# Altium project CRD25DA12N-FMC V2 (09-2024).PrjPcb (part 2 of 9)

## Sheet 03 - Controller.SchDoc: Controller - 25kW WolfPACK FM3 Six-Pack Inverter
size 431 x 279 mm; Date: 09/2024; DocumentNumber: CRD25DA12N-FMC; Revision: 2.0; SheetNumber: 3; SheetTotal: 9; SheetSize: B
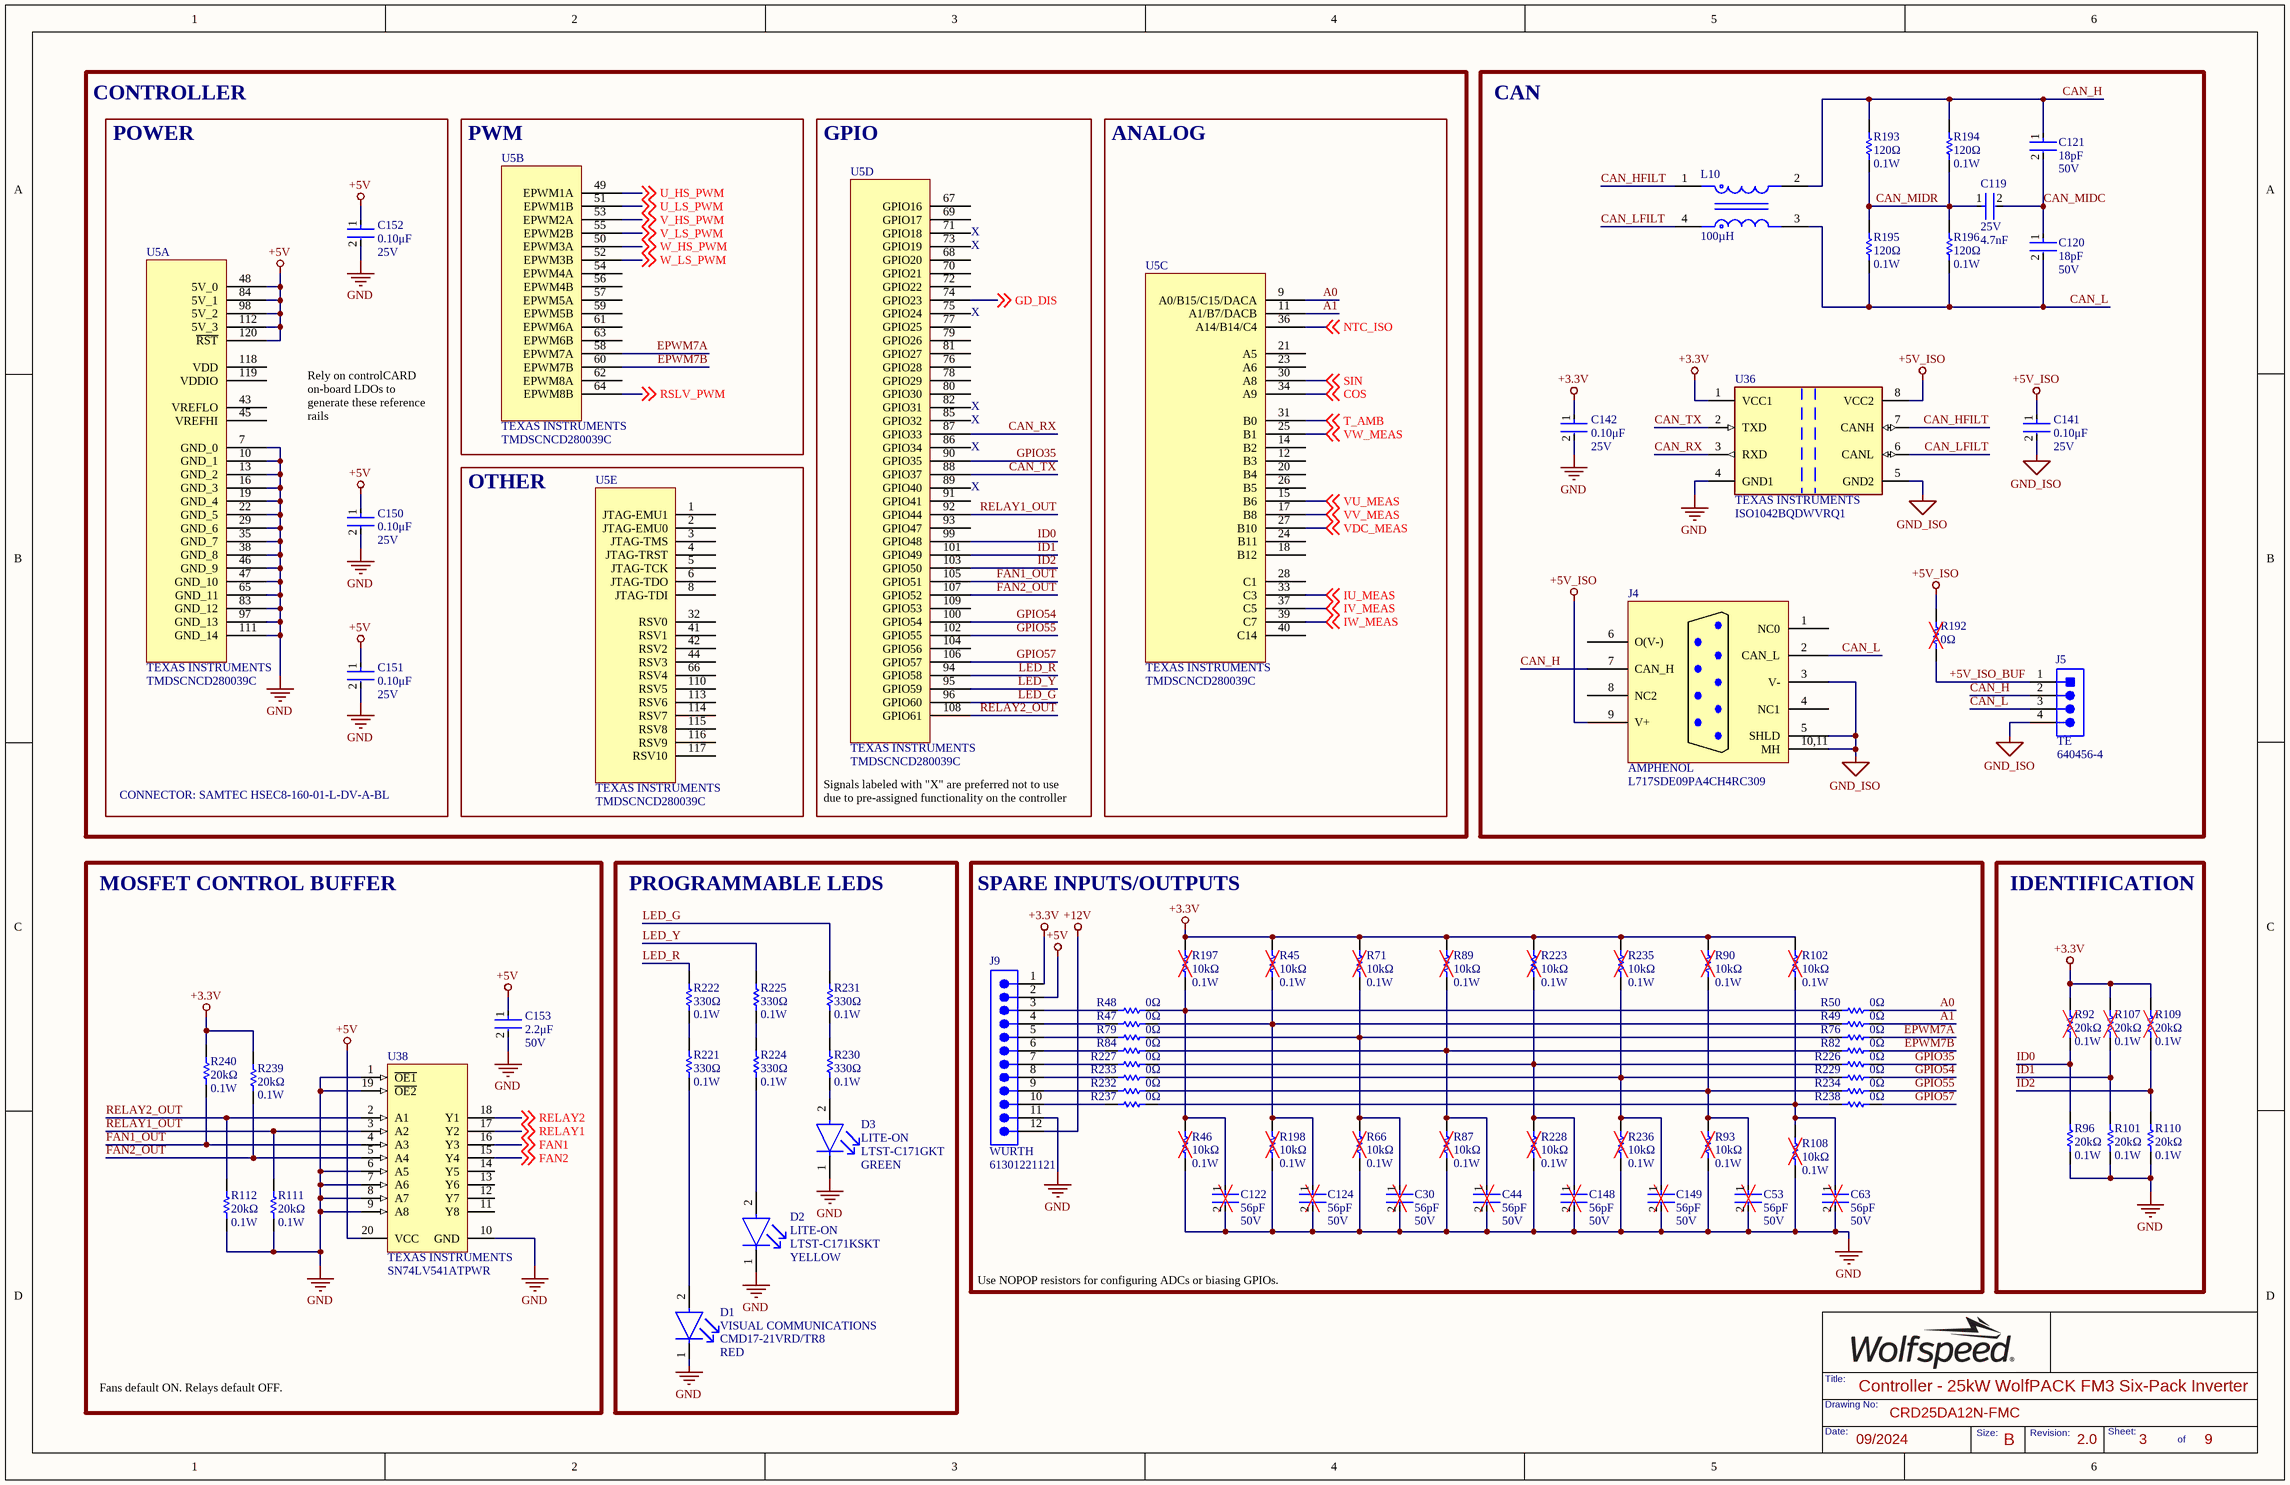
[diagram p2: 03 - Controller.SchDoc]

### Parts
C30  Capacitance: 56pF  Voltage Rating: 50V  [FP-C0603C-CF-IPC_B]  (hidden comment: CL10C560JB8NNNC)
C44  Capacitance: 56pF  Voltage Rating: 50V  [FP-C0603C-CF-IPC_B]  (hidden comment: CL10C560JB8NNNC)
C53  Capacitance: 56pF  Voltage Rating: 50V  [FP-C0603C-CF-IPC_B]  (hidden comment: CL10C560JB8NNNC)
C63  Capacitance: 56pF  Voltage Rating: 50V  [FP-C0603C-CF-IPC_B]  (hidden comment: CL10C560JB8NNNC)
C119  Voltage Rating: 25V  Capacitance: 4.7nF  [FP-C0603C-CF-IPC_B]  (hidden comment: C0603C472K3RAC7867)
C120  Capacitance: 18pF  Voltage Rating: 50V  [FP-C0603C-CF-IPC_B]  (hidden comment: 06035A180JAT2A)
C121  Capacitance: 18pF  Voltage Rating: 50V  [FP-C0603C-CF-IPC_B]  (hidden comment: 06035A180JAT2A)
C122  Capacitance: 56pF  Voltage Rating: 50V  [FP-C0603C-CF-IPC_B]  (hidden comment: CL10C560JB8NNNC)
C124  Capacitance: 56pF  Voltage Rating: 50V  [FP-C0603C-CF-IPC_B]  (hidden comment: CL10C560JB8NNNC)
C141  Voltage Rating: 25V  Capacitance: 0.10μF  [FP-C0603C-CF-IPC_B]  (hidden comment: C0603C104K3RACTU)
C142  Voltage Rating: 25V  Capacitance: 0.10μF  [FP-C0603C-CF-IPC_B]  (hidden comment: C0603C104K3RACTU)
C148  Capacitance: 56pF  Voltage Rating: 50V  [FP-C0603C-CF-IPC_B]  (hidden comment: CL10C560JB8NNNC)
C149  Capacitance: 56pF  Voltage Rating: 50V  [FP-C0603C-CF-IPC_B]  (hidden comment: CL10C560JB8NNNC)
C150  Voltage Rating: 25V  Capacitance: 0.10μF  [FP-C0603C-CF-IPC_B]  (hidden comment: C0603C104K3RACTU)
C151  Voltage Rating: 25V  Capacitance: 0.10μF  [FP-C0603C-CF-IPC_B]  (hidden comment: C0603C104K3RACTU)
C152  Voltage Rating: 25V  Capacitance: 0.10μF  [FP-C0603C-CF-IPC_B]  (hidden comment: C0603C104K3RACTU)
C153  Voltage Rating: 50V  Capacitance: 2.2μF  [FP-C0603C-CF-IPC_B]  (hidden comment: GRT188R61H225ME13D)
D1  value RED  Manufacturer: VISUAL COMMUNICATIONS  [FP-LTST-C171GKT-MFG-RED]  (hidden comment: CMD17-21VRD/TR8)
D2  LTST-C171KSKT  value YELLOW  Manufacturer: LITE-ON  [FP-LTST-C171GKT-MFG-YELLOW]
D3  value GREEN  Manufacturer: LITE-ON  [FP-LTST-C171GKT-MFG]  (hidden comment: LTST-C171GKT)
J4  Manufacturer: AMPHENOL  [L717SDE09PA4CH4RC309]  (hidden comment: L717SDE09PA4CH4RC309)
J5  Manufacturer: TE  [TECO-640456-4]  (hidden comment: 640456-4)
J9  Manufacturer Print: WURTH  [FP-61301221121-MFG]  (hidden comment: 61301221121)
L10  value 100µH  [FP-DLW43-0_2-t2_6-e0_6-MFG]  (hidden comment: DLW43SH101XK2L)
R45  Resistance: 10kΩ  Max Power Dissipation: 0.1W  [FP-MCR03-IPC_B]  (hidden comment: ERJ3EKF1002V)
R46  Resistance: 10kΩ  Max Power Dissipation: 0.1W  [FP-MCR03-IPC_B]  (hidden comment: ERJ3EKF1002V)
R47  Resistance: 0Ω  [FP-MCR03-IPC_B]  (hidden comment: CRCW06030000Z0EB)
R48  Resistance: 0Ω  [FP-MCR03-IPC_B]  (hidden comment: CRCW06030000Z0EB)
R49  Resistance: 0Ω  [FP-MCR03-IPC_B]  (hidden comment: CRCW06030000Z0EB)
R50  Resistance: 0Ω  [FP-MCR03-IPC_B]  (hidden comment: CRCW06030000Z0EB)
R66  Resistance: 10kΩ  Max Power Dissipation: 0.1W  [FP-MCR03-IPC_B]  (hidden comment: ERJ3EKF1002V)
R71  Resistance: 10kΩ  Max Power Dissipation: 0.1W  [FP-MCR03-IPC_B]  (hidden comment: ERJ3EKF1002V)
R76  Resistance: 0Ω  [FP-MCR03-IPC_B]  (hidden comment: CRCW06030000Z0EB)
R79  Resistance: 0Ω  [FP-MCR03-IPC_B]  (hidden comment: CRCW06030000Z0EB)
R82  Resistance: 0Ω  [FP-MCR03-IPC_B]  (hidden comment: CRCW06030000Z0EB)
R84  Resistance: 0Ω  [FP-MCR03-IPC_B]  (hidden comment: CRCW06030000Z0EB)
R87  Resistance: 10kΩ  Max Power Dissipation: 0.1W  [FP-MCR03-IPC_B]  (hidden comment: ERJ3EKF1002V)
R89  Resistance: 10kΩ  Max Power Dissipation: 0.1W  [FP-MCR03-IPC_B]  (hidden comment: ERJ3EKF1002V)
R90  Resistance: 10kΩ  Max Power Dissipation: 0.1W  [FP-MCR03-IPC_B]  (hidden comment: ERJ3EKF1002V)
R92  Resistance: 20kΩ  Power Rating: 0.1W  [FP-MCR03-IPC_B]  (hidden comment: CRCW060320K0FKTA)
R93  Resistance: 10kΩ  Max Power Dissipation: 0.1W  [FP-MCR03-IPC_B]  (hidden comment: ERJ3EKF1002V)
R96  Resistance: 20kΩ  Power Rating: 0.1W  [FP-MCR03-IPC_B]  (hidden comment: CRCW060320K0FKTA)
R101  Resistance: 20kΩ  Power Rating: 0.1W  [FP-MCR03-IPC_B]  (hidden comment: CRCW060320K0FKTA)
R102  Resistance: 10kΩ  Max Power Dissipation: 0.1W  [FP-MCR03-IPC_B]  (hidden comment: ERJ3EKF1002V)
R107  Resistance: 20kΩ  Power Rating: 0.1W  [FP-MCR03-IPC_B]  (hidden comment: CRCW060320K0FKTA)
R108  Resistance: 10kΩ  Max Power Dissipation: 0.1W  [FP-MCR03-IPC_B]  (hidden comment: ERJ3EKF1002V)
R109  Resistance: 20kΩ  Power Rating: 0.1W  [FP-MCR03-IPC_B]  (hidden comment: CRCW060320K0FKTA)
R110  Resistance: 20kΩ  Power Rating: 0.1W  [FP-MCR03-IPC_B]  (hidden comment: CRCW060320K0FKTA)
R111  Resistance: 20kΩ  Power Rating: 0.1W  [FP-MCR03-IPC_B]  (hidden comment: CRCW060320K0FKTA)
R112  Resistance: 20kΩ  Power Rating: 0.1W  [FP-MCR03-IPC_B]  (hidden comment: CRCW060320K0FKTA)
R192  Resistance: 0Ω  [FP-MCR03-IPC_B]  (hidden comment: CRCW06030000Z0EB)
R193  value 120Ω  Max Power Dissipation: 0.1W  [FP-MCR03-IPC_B]  (hidden comment: RC0603JR-07120RL)
R194  value 120Ω  Max Power Dissipation: 0.1W  [FP-MCR03-IPC_B]  (hidden comment: RC0603JR-07120RL)
R195  value 120Ω  Max Power Dissipation: 0.1W  [FP-MCR03-IPC_B]  (hidden comment: RC0603JR-07120RL)
R196  value 120Ω  Max Power Dissipation: 0.1W  [FP-MCR03-IPC_B]  (hidden comment: RC0603JR-07120RL)
R197  Resistance: 10kΩ  Max Power Dissipation: 0.1W  [FP-MCR03-IPC_B]  (hidden comment: ERJ3EKF1002V)
R198  Resistance: 10kΩ  Max Power Dissipation: 0.1W  [FP-MCR03-IPC_B]  (hidden comment: ERJ3EKF1002V)
R221  Resistance: 330Ω  Power Rating: 0.1W  [FP-MCR03-IPC_B]  (hidden comment: RC0603FR-13330RL)
R222  Resistance: 330Ω  Power Rating: 0.1W  [FP-MCR03-IPC_B]  (hidden comment: RC0603FR-13330RL)
R223  Resistance: 10kΩ  Max Power Dissipation: 0.1W  [FP-MCR03-IPC_B]  (hidden comment: ERJ3EKF1002V)
R224  Resistance: 330Ω  Power Rating: 0.1W  [FP-MCR03-IPC_B]  (hidden comment: RC0603FR-13330RL)
R225  Resistance: 330Ω  Power Rating: 0.1W  [FP-MCR03-IPC_B]  (hidden comment: RC0603FR-13330RL)
R226  Resistance: 0Ω  [FP-MCR03-IPC_B]  (hidden comment: CRCW06030000Z0EB)
R227  Resistance: 0Ω  [FP-MCR03-IPC_B]  (hidden comment: CRCW06030000Z0EB)
R228  Resistance: 10kΩ  Max Power Dissipation: 0.1W  [FP-MCR03-IPC_B]  (hidden comment: ERJ3EKF1002V)
R229  Resistance: 0Ω  [FP-MCR03-IPC_B]  (hidden comment: CRCW06030000Z0EB)
R230  Resistance: 330Ω  Power Rating: 0.1W  [FP-MCR03-IPC_B]  (hidden comment: RC0603FR-13330RL)
R231  Resistance: 330Ω  Power Rating: 0.1W  [FP-MCR03-IPC_B]  (hidden comment: RC0603FR-13330RL)
R232  Resistance: 0Ω  [FP-MCR03-IPC_B]  (hidden comment: CRCW06030000Z0EB)
R233  Resistance: 0Ω  [FP-MCR03-IPC_B]  (hidden comment: CRCW06030000Z0EB)
R234  Resistance: 0Ω  [FP-MCR03-IPC_B]  (hidden comment: CRCW06030000Z0EB)
R235  Resistance: 10kΩ  Max Power Dissipation: 0.1W  [FP-MCR03-IPC_B]  (hidden comment: ERJ3EKF1002V)
R236  Resistance: 10kΩ  Max Power Dissipation: 0.1W  [FP-MCR03-IPC_B]  (hidden comment: ERJ3EKF1002V)
R237  Resistance: 0Ω  [FP-MCR03-IPC_B]  (hidden comment: CRCW06030000Z0EB)
R238  Resistance: 0Ω  [FP-MCR03-IPC_B]  (hidden comment: CRCW06030000Z0EB)
R239  Resistance: 20kΩ  Power Rating: 0.1W  [FP-MCR03-IPC_B]  (hidden comment: CRCW060320K0FKTA)
R240  Resistance: 20kΩ  Power Rating: 0.1W  [FP-MCR03-IPC_B]  (hidden comment: CRCW060320K0FKTA)
U5  TMDSCNCD280039C  Manufacturer: TEXAS INSTRUMENTS  [TMDSCNCD280039C]  (parts A,B,C,D,E of 5)
U36  Manufacturer: TEXAS INSTRUMENTS  [FP-DWV0008A-IPC_B]  (hidden comment: ISO1042BQDWVRQ1)
U38  Manufacturer: TEXAS INSTRUMENTS  [PW0020A_L]  (hidden comment: SN74LV541ATPWR)

### Blocks framed on the sheet
CAN: C119-C121 C141 C142 J4 J5 L10 R192-R196 U36
POWER: C150-C152 U5
PWM: U5
GPIO: U5
ANALOG: U5
OTHER: U5
MOSFET CONTROL BUFFER: C153 R111 R112 R239 R240 U38
PROGRAMMABLE LEDS: D1-D3 R221 R222 R224 R225 R230 R231
SPARE INPUTS/OUTPUTS: C30 C44 C53 C63 C122 C124 C148 C149 J9 R45-R50 R66 R71 R76 R79 R82 R84 R87 R89 R90 R93 R102 R108 R197 R198 R223 R226-R229 R232-R238
IDENTIFICATION: R92 R96 R101 R107 R109 R110

### Nets
+3.3V: C142.1 J9.1 R45.2 R71.2 R89.2 R90.2 R92.2 R102.2 R107.2 R109.2 R197.2 R223.2 R235.2 R239.2 R240.2 U36.1(VCC1)
+5V: C150.1 C151.1 C152.1 C153.1 J9.2 U5.48(5V_0) U5.84(5V_1) U5.98(5V_2) U5.112(5V_3) U5.120(~{RST}) U38.20(VCC)
+5V_ISO: C141.1 J4.9(V+) R192.2 U36.8(VCC2)
+12V: J9.12
GND: C30.2 C44.2 C53.2 C63.2 C122.2 C124.2 C142.2 C148.2 C149.2 C150.2 C151.2 C152.2 C153.2 D1.1(C) D2.1(C) D3.1(C) J9.11 R46.1 R66.1 R87.1 R93.1 R96.1 R101.1 R108.1 R110.1 R111.1 R112.1 R198.1 R228.1 R236.1 U5.7(GND_0) U5.10(GND_1) U5.13(GND_2) U5.16(GND_3) U5.19(GND_4) U5.22(GND_5) U5.29(GND_6) U5.35(GND_7) U5.38(GND_8) U5.46(GND_9) U5.47(GND_10) U5.65(GND_11) U5.83(GND_12) U5.97(GND_13) U5.111(GND_14) U36.4(GND1) U38.1(~{OE1}) U38.6(A5) U38.7(A6) U38.8(A7) U38.9(A8) U38.10(GND) U38.19(~{OE2})
GND_ISO: C141.2 J4.3(V-) J4.5(SHLD) J4.10,11(MH) J5.4 U36.5(GND2)
+5V_ISO_BUF: J5.1 R192.1
A0: R50.2 U5.9(A0/B15/C15/DACA)
A1: R49.2 U5.11(A1/B7/DACB)
CAN_H: C121.1 J4.7(CAN_H) J5.2 L10.2 R193.2 R194.2
CAN_HFILT: L10.1 U36.7(CANH)
CAN_L: C120.2 J4.2(CAN_L) J5.3 L10.3 R195.1 R196.1
CAN_LFILT: L10.4 U36.6(CANL)
CAN_MIDC: C119.2 C120.1 C121.2
CAN_MIDR: C119.1 R193.1 R194.1 R195.2 R196.2
CAN_RX: U5.87(GPIO33) U36.3(RXD)
CAN_TX: U5.88(GPIO37) U36.2(TXD)
COS: U5.34(A9) ; off-sheet COS
EPWM7A: R76.2 U5.58(EPWM7A)
EPWM7B: R82.2 U5.60(EPWM7B)
FAN1: U38.16(Y3) ; off-sheet FAN1
FAN1_OUT: R240.1 U5.105(GPIO51) U38.4(A3)
FAN2: U38.15(Y4) ; off-sheet FAN2
FAN2_OUT: R239.1 U5.107(GPIO52) U38.5(A4)
GD_DIS: U5.74(GPIO23) ; off-sheet GD_DIS
GPIO35: R226.2 U5.90(GPIO35)
GPIO54: R229.2 U5.100(GPIO54)
GPIO55: R234.2 U5.102(GPIO55)
GPIO57: R238.2 U5.106(GPIO57)
ID0: R92.1 R96.2 U5.99(GPIO48)
ID1: R101.2 R107.1 U5.101(GPIO49)
ID2: R109.1 R110.2 U5.103(GPIO50)
IU_MEAS: U5.33(C3) ; off-sheet IU_MEAS
IV_MEAS: U5.37(C5) ; off-sheet IV_MEAS
IW_MEAS: U5.39(C7) ; off-sheet IW_MEAS
LED_G: R231.2 U5.96(GPIO60)
LED_R: R222.2 U5.94(GPIO58)
LED_Y: R225.2 U5.95(GPIO59)
NTC_ISO: U5.36(A14/B14/C4) ; off-sheet NTC_ISO
RELAY1: U38.17(Y2) ; off-sheet RELAY1
RELAY1_OUT: R111.2 U5.92(GPIO44) U38.3(A2)
RELAY2: U38.18(Y1) ; off-sheet RELAY2
RELAY2_OUT: R112.2 U5.108(GPIO61) U38.2(A1)
RSLV_PWM: U5.64(EPWM8B) ; off-sheet RSLV_PWM
SIN: U5.30(A8) ; off-sheet SIN
T_AMB: U5.31(B0) ; off-sheet T_AMB
U_HS_PWM: U5.49(EPWM1A) ; off-sheet U_HS_PWM
U_LS_PWM: U5.51(EPWM1B) ; off-sheet U_LS_PWM
V_HS_PWM: U5.53(EPWM2A) ; off-sheet V_HS_PWM
V_LS_PWM: U5.55(EPWM2B) ; off-sheet V_LS_PWM
VDC_MEAS: U5.27(B10) ; off-sheet VDC_MEAS
VU_MEAS: U5.15(B6) ; off-sheet VU_MEAS
VV_MEAS: U5.17(B8) ; off-sheet VV_MEAS
VW_MEAS: U5.25(B1) ; off-sheet VW_MEAS
W_HS_PWM: U5.50(EPWM3A) ; off-sheet W_HS_PWM
W_LS_PWM: U5.52(EPWM3B) ; off-sheet W_LS_PWM
NetC30_1: C30.1 R66.2 R71.1 R76.1 R79.2
NetC44_1: C44.1 R82.1 R84.2 R87.2 R89.1
NetC53_1: C53.1 R90.1 R93.2 R232.2 R234.1
NetC63_1: C63.1 R102.1 R108.2 R237.2 R238.1
NetC122_1: C122.1 R46.2 R48.2 R50.1 R197.1
NetC124_1: C124.1 R45.1 R47.2 R49.1 R198.2
NetC148_1: C148.1 R223.1 R226.1 R227.2 R228.2
NetC149_1: C149.1 R229.1 R233.2 R235.1 R236.2
NetD1_2: D1.2(A) R221.1
NetD2_2: D2.2(A) R224.1
NetD3_2: D3.2(A) R230.1
NetJ9_3: J9.3 R48.1
NetJ9_4: J9.4 R47.1
NetJ9_5: J9.5 R79.1
NetJ9_6: J9.6 R84.1
NetJ9_7: J9.7 R227.1
NetJ9_8: J9.8 R233.1
NetJ9_9: J9.9 R232.1
NetJ9_10: J9.10 R237.1
NetR221_2: R221.2 R222.1
NetR224_2: R224.2 R225.1
NetR230_2: R230.2 R231.1

Not connected (* = marked no-connect by the designer): J4 1(NC0) 4(NC1) 6(O(V-)) 8(NC2); U5 1(JTAG-EMU1) 2(JTAG-EMU0) 3(JTAG-TMS) 4(JTAG-TRST) 5(JTAG-TCK) 6(JTAG-TDO) 8(JTAG-TDI) 12(B3) 14(B2) 18(B12) 20(B4) 21(A5) 23(A6) 24(B11) 26(B5) 28(C1) 32(RSV0) 40(C14) 41(RSV1) 42(RSV2) 43(VREFLO) 44(RSV3) 45(VREFHI) 54(EPWM4A) 56(EPWM4B) 57(EPWM5A) 59(EPWM5B) 61(EPWM6A) 62(EPWM8A) 63(EPWM6B) 66(RSV4) 67(GPIO16) 68(GPIO20) 69(GPIO17) 70(GPIO21) 71(GPIO18) 72(GPIO22) 73(GPIO19) 75(GPIO24) 76(GPIO28) 77(GPIO25) 78(GPIO29) 79(GPIO26) 80(GPIO30) 81(GPIO27) 82(GPIO31) 85(GPIO32) 86(GPIO34) 89(GPIO40) 91(GPIO41) 93(GPIO47) 104(GPIO56) 109(GPIO53) 110(RSV5) 113(RSV6) 114(RSV7) 115(RSV8) 116(RSV9) 117(RSV10) 118(VDD) 119(VDDIO); U38 11(Y8) 12(Y7) 13(Y6) 14(Y5)

### Notes on the sheet
- CONTROLLER
- (near U5) X
- Rely on controlCARD on-board LDOs to generate these reference rails
- CONNECTOR: SAMTEC HSEC8-160-01-L-DV-A-BL
- Signals labeled with "X" are preferred not to use due to pre-assigned functionality on the controller
- Use NOPOP resistors for configuring ADCs or biasing GPIOs.
- Fans default ON. Relays default OFF.
- Title:
- Date:
- Drawing No:
- Size:
- Revision:
- Sheet:
- of

### Library data of the parts
C30 C44 C53 C63 C122 C124 C148 C149 = CL10C560JB8NNNC: CAP CER 56PF 50V C0G/NP0 0603; Manufacturer: SAMSUNG; Material: Ceramic; Tolerance: 5%; Dielectric: C0G; Temperature Coefficient: 30ppm/°C; Supplier 1: Arrow Electronics; Manufacturer Part Number: CL10C560JB8NNNC; RoHS: Yes; Category: Ceramic Capacitors; Stock 1: 60182; Pricing 1: 1=0.05960, 10=0.01370, 25=0.01360, 100=0.01080, 250=0.01070, 500=0.00740, 1000=0.00590, 3000=0.00560, 6000=0.00530, 15000=0.00500, 30000=0.00470 (USD); Mount: Surface Mount; Case Code (Metric): 1608; Case Code (Imperial): 0603; Min Operating Temperature: -55°C; Max Operating Temperature: 125°C; Packaging: Tape and Reel; Package Quantity: 1; Voltage: 50V; Voltage Rating (DC): 50V; Series: CL; Construction: Flat; Termination: SMD/SMT; Length: 1.6mm; Width: 0.031inch; Height: 0.8mm; Thickness: 0.035inch; Depth: 0.8mm; Radiation Hardening: No; Lead Free: Lead Free; RoHS Compliant: Yes; ComponentLink1URL: https://datasheet.ciiva.com/25803/cl10c560jb8nnnc-25803592.pdf?src-supplier=Digi-Key; ComponentLink1Description: https://datasheet.ciiva.com/25803/cl10c560jb8nnnc-25803592.pdf?src-supplier=Digi-Key; ComponentLink2URL: https://datasheet.ciiva.com/26838/getdatasheetpartid-640760-26838546.pdf?src-supplier=Verical; ComponentLink2Description: https://datasheet.ciiva.com/26838/getdatasheetpartid-640760-26838546.pdf?src-supplier=Verical; ComponentLink3URL: https://datasheet.ciiva.com/29198/456837-da-01-en-vs-kondensator-0603-29198873.pdf?src-supplier=Conrad; ComponentLink3Description: https://datasheet.ciiva.com/29198/456837-da-01-en-vs-kondensator-0603-29198873.pdf?src-supplier=Conrad; ComponentLink4URL: https://datasheet.ciiva.com/48428/mlcc-catalogdownload2013-eng-48428598.pdf?src-supplier=Distrelec; ComponentLink4Description: https://datasheet.ciiva.com/48428/mlcc-catalogdownload2013-eng-48428598.pdf?src-supplier=Distrelec; ComponentLink5URL: https://datasheet.ciiva.com/16449/cl05b104kq5nnnc-16449527.pdf?src-supplier=Future+Electronics; ComponentLink5Description: https://datasheet.ciiva.com/16449/cl05b104kq5nnnc-16449527.pdf?src-supplier=Future+Electronics; Supplier Part Number 1: CL10C560JB8NNNC; Package: 0603; Value: 56pF
C119 = C0603C472K3RAC7867: CAP CER 4700PF 25V 10% X7R 0603; Manufacturer: KEMET; Manufacturer Part Number: C0603C472K3RACTU; Dielectric Material: Ceramic; Value: 4.7nF; Supplier 1: Newark; RoHS: Yes; Category: Ceramic Capacitors; Stock 1: 8000; Pricing 1: 1=0.04800, 4000=0.04800 (USD); Mount: Surface Mount; Package: 0603; Case Code (Metric): 1608; Case Code (Imperial): 0603; Min Operating Temperature: -55°C; Max Operating Temperature: 125°C; Tolerance: 10%; Dielectric: X7R; Packaging: Tape and Reel; Package Quantity: 1; Voltage Rating (DC): 25V; Termination: SMD/SMT; Dissipation Factor: 10%; Series: C; Construction: Flat; Length: 1.6mm; Width: 0.031inch; Height: 0.8mm; Thickness: 0.034inch; Lead Pitch: 0.7mm; Depth: 0.8mm; Radiation Hardening: No; Reach SVHC Compliant: Yes; RoHS Compliant: Yes; ComponentLink1URL: https://datasheet.ciiva.com/5414/kem-c1002-x7r-smd-357932-5414293.pdf?src-supplier=Mouser; ComponentLink1Description: https://datasheet.ciiva.com/5414/kem-c1002-x7r-smd-357932-5414293.pdf?src-supplier=Mouser; Supplier Part Number 1: 67AH9250
C120 C121 = 06035A180JAT2A: CAP CER 18PF 50V C0G/NP0 0603; Manufacturer: KYOCERA AVX; Dielectric Material: Ceramic; Tolerance: 5%; Dielectric: C0G; Insulation Resistance: 100GR; Temperature Coefficient: 30ppm/°C; Supplier 1: Rs; Manufacturer Part Number: 06035A180JAT2A; RoHS: Yes; Category: Ceramic Capacitors; Stock 1: 1; Pricing 1: 4000=0.01900, 12000=0.01700 (USD); Mount: Surface Mount; Number of Pins: 2; Case Code (Imperial): 0603; Case Code (Metric): 1608; Contact Plating: Tin,Matte; Min Operating Temperature: -55°C; Max Operating Temperature: 125°C; Packaging: Tape and Reel; Voltage Rating (DC): 50V; Series: -; Package Quantity: 1; Termination: SMD/SMT; Voltage: 50V; Length: 1.6mm; Width: 0.032inch; Height: 0.86mm; Thickness: 0.035inch; Depth: 0.81mm; Radiation Hardening: No; Reach SVHC Compliant: Yes; Lead Free: Lead Free; RoHS Compliant: Yes; ComponentLink1URL: https://datasheet.ciiva.com/1124/84496-1124722.pdf?src-supplier=Element14; ComponentLink1Description: https://datasheet.ciiva.com/1124/84496-1124722.pdf?src-supplier=Element14; ComponentLink2URL: https://datasheet.ciiva.com/22699/84496-22699967.pdf?src-supplier=Element14; ComponentLink2Description: https://datasheet.ciiva.com/22699/84496-22699967.pdf?src-supplier=Element14; ComponentLink3URL: https://datasheet.ciiva.com/7855/759117-7855062.pdf?src-supplier=Element14; ComponentLink3Description: https://datasheet.ciiva.com/7855/759117-7855062.pdf?src-supplier=Element14; ComponentLink4URL: https://datasheet.ciiva.com/7855/84496-7855222.pdf?src-supplier=Element14; ComponentLink4Description: https://datasheet.ciiva.com/7855/84496-7855222.pdf?src-supplier=Element14; ComponentLink5URL: https://datasheet.ciiva.com/150/ccog-150276.pdf?src-supplier=Digi-Key; ComponentLink5Description: https://datasheet.ciiva.com/150/ccog-150276.pdf?src-supplier=Digi-Key; ComponentLink6URL: https://datasheet.ciiva.com/150/ccog-150277.pdf?src-supplier=Digi-Key; ComponentLink6Description: https://datasheet.ciiva.com/150/ccog-150277.pdf?src-supplier=Digi-Key; Supplier Part Number 1: 1349617; Package: 0603; Value: 18pF
C141 C142 C150-C152 = CMP-2006-03057-2: CAP CER 0.1UF 25V X7R 0603; Manufacturer: KEMET; Value: 0.10μF; Material: Ceramic; Tolerance: 0.1; Temperature Coefficient: 30ppm/°C; Automotive Grade: Grade 1; Lead Free: Yes; Device Class L3: Ceramic Capacitors; Manufacturer Part Number: C0603C104K3RACTU; Digikey Description: CAP CER 0.1UF 25V X7R 0603; Mouser Description: Multilayer Ceramic Capacitors MLCC - SMD/SMT 25volts 0.1uF X7R 10%; Package: 0603; Temperature Range Low: -55°C; Automotive: Yes; Device Class L2: Capacitors; Octopart: https://octopart.com/c0603c104k3ractu-kemet-127541; ComponentLink2Description: Datasheet; ComponentLink2URL: https://api.kemet.com/component-edge/download/datasheet/C0603C100J5GACAUTO.pdf; Temperature Range High: +125°C; RoHS: TRUE; Device Class L1: Passive Components; Category: Cap; Temperature: -55°C to +125°C; Height: 0.87mm; Temperature Characteristic: X7R
C153 = GRT188R61H225ME13D: CAP CER 2.2UF 50V X5R 0603; Manufacturer: MURATA; Tolerance: 20%; Value: 2.2μF; Supplier 1: Arrow Electronics; Manufacturer Part Number: GRT188R61H225ME13D; RoHS: Yes; Category: Ceramic Capacitors; Stock 1: 3937; Pricing 1: 1=0.29580, 10=0.20370, 25=0.18090, 100=0.12380, 250=0.12190, 500=0.10920, 1000=0.07700, 3000=0.07630 (USD); Mount: Surface Mount; Case Code (Metric): 1608; Case Code (Imperial): 0603; Min Operating Temperature: -55°C; Max Operating Temperature: 85°C; Packaging: Tape and Reel; Length: 0.063inch; Width: 0.031inch; Thickness: 0.035inch; Ratings: AEC-Q200; RoHS Compliant: Yes; ComponentLink1URL: http://search.murata.co.jp/Ceramy/image/img/A01X/G101/ENG/GRT188R61H225ME13-01.pdf?src-supplier=Digi-Key; ComponentLink1Description: http://search.murata.co.jp/Ceramy/image/img/A01X/G101/ENG/GRT188R61H225ME13-01.pdf?src-supplier=Digi-Key; ComponentLink2URL: https://search.murata.co.jp/Ceramy/image/img/A01X/G101/ENG/GRT188R61H225ME13-01.pdf?src-supplier=Digi-Key; ComponentLink2Description: https://search.murata.co.jp/Ceramy/image/img/A01X/G101/ENG/GRT188R61H225ME13-01.pdf?src-supplier=Digi-Key; Supplier Part Number 1: GRT188R61H225ME13D; Package: 0603
D1 = CMD17-21VRD/TR8: LED RED DIFFUSED 0805 SMD; Power Rating: 100mW; Luminous Intensity: 6mcd; Viewing Angle: 140°; Lens Style: Diffused,Tinted,Rectangular,Colored; Forward Current: 20mA; Forward Voltage: 2V; Wavelength: 640nm; Reverse Voltage (DC): 5V; Number of LEDs: 1; Supplier 1: Newark; RoHS: Yes; Category: LEDs; Stock 1: 1791; Pricing 1: 1=0.55000, 25=0.37500, 50=0.31600, 100=0.25700, 250=0.25600, 500=0.25400, 1000=0.21500 (USD); Mount: Surface Mount; Package: 0805; Number of Pins: 2; Color: RED; Case Code (Metric): 2012; Case Code (Imperial): 0805; Lens Color: Red; Min Operating Temperature: -40°C; Max Operating Temperature: 85°C; Packaging: Tape and Reel; Package Quantity: 1; Illumination Color: Red; Test Current: 20mA; Reverse Voltage: 5V; Length: 2mm; Width: 1.25mm; Height: 1.1mm; RoHS Compliant: Yes; Lead Free: Lead Free; ComponentLink1URL: http://www.mouser.com/ds/2/423/CMD1721ver1-1064576.pdf?src-supplier=Mouser; ComponentLink1Description: http://www.mouser.com/ds/2/423/CMD1721ver1-1064576.pdf?src-supplier=Mouser; ComponentLink2URL: https://www.alliedelec.com/m/d/ea8f758becbd32522d2612194452bcae.pdf?src-supplier=Allied+Electronics; ComponentLink2Description: https://www.alliedelec.com/m/d/ea8f758becbd32522d2612194452bcae.pdf?src-supplier=Allied+Electronics; ComponentLink3URL: http://www.onlinecomponents.com/productFiles/mf-CM/2cmd17-21seriessmtleds0805packagesize.pdf?src-supplier=Onlinecomponents.com; ComponentLink3Description: http://www.onlinecomponents.com/productFiles/mf-CM/2cmd17-21seriessmtleds0805packagesize.pdf?src-supplier=Onlinecomponents.com; ComponentLink4URL: https://vcclite.com/wp-content/uploads/wpallimport/files/files/CMD1721Seriesver3.pdf?src-supplier=Digi-Key; ComponentLink4Description: https://vcclite.com/wp-content/uploads/wpallimport/files/files/CMD1721Seriesver3.pdf?src-supplier=Digi-Key; Supplier Part Number 1: 45X6246; Manufacturer Part Number: CMD17-21VRD/TR8
D2 = LTST-C171KSKT: LED YELLOW CLEAR 0805 SMD; Lens Color: Colorless; Number of LEDs: 1; Reverse Voltage: 5V; Viewing Angle: 130°; Lens Style: Diffused,Colorless,Rectangular,Clear; Luminous Intensity: 50mcd; Forward Voltage: 2V; Dominant Wavelength: 587nm; Test Current: 20mA; Wavelength: 588nm; Forward Current: 30mA; Max Power Dissipation: 75mW; Supplier 1: Rs; Manufacturer Part Number: LTST-C171KSKT; RoHS: Yes; Category: LEDs; Stock 1: 850; Mount: Surface Mount; Package: 0805; Number of Pins: 2; Color: Yellow; Case Code (Metric): 2012; Case Code (Imperial): 0805; Min Operating Temperature: -55°C; Max Operating Temperature: 85°C; Package Quantity: 1; Packaging: Tape and Reel; Lens Transparency: Clear; Series: CHIPLED 0805; Illumination Color: Yellow; Power Rating: 75mW; Number of Elements: 1; Power Dissipation: 75mW; Length: 2mm; Width: 1.25mm; Height: 0.8mm; Depth: 1.25mm; Radiation Hardening: No; Lead Free: Lead Free; RoHS Compliant: Yes; ComponentLink1URL: https://datasheet.ciiva.com/19466/2075639-19466196.pdf?src-supplier=Jameco; ComponentLink1Description: https://datasheet.ciiva.com/19466/2075639-19466196.pdf?src-supplier=Jameco; ComponentLink2URL: https://datasheet.ciiva.com/12403/lite-on-ltst-c171kskt-190118-12403721.pdf?src-supplier=Mouser; ComponentLink2Description: https://datasheet.ciiva.com/12403/lite-on-ltst-c171kskt-190118-12403721.pdf?src-supplier=Mouser; ComponentLink3URL: https://datasheet.ciiva.com/16200/lite-on20ltst-c171kskt-16200102.pdf?src-supplier=Future+Electronics; ComponentLink3Description: https://datasheet.ciiva.com/16200/lite-on20ltst-c171kskt-16200102.pdf?src-supplier=Future+Electronics; ComponentLink4URL: https://datasheet.ciiva.com/15118/getdatasheetpartid-233685-15118145.pdf?src-supplier=Verical; ComponentLink4Description: https://datasheet.ciiva.com/15118/getdatasheetpartid-233685-15118145.pdf?src-supplier=Verical; ComponentLink5URL: https://datasheet.ciiva.com/11774/0900766b80dc029a-11774587.pdf?src-supplier=Rs; ComponentLink5Description: https://datasheet.ciiva.com/11774/0900766b80dc029a-11774587.pdf?src-supplier=Rs; ComponentLink6URL: https://datasheet.ciiva.com/2110/s-110-ltst-c171kskt-2110148.pdf?src-supplier=Digi-Key; ComponentLink6Description: https://datasheet.ciiva.com/2110/s-110-ltst-c171kskt-2110148.pdf?src-supplier=Digi-Key; ComponentLink7URL: https://datasheet.ciiva.com/2110/s-110-ltst-c171kskt-2110147.pdf?src-supplier=Digi-Key; ComponentLink7Description: https://datasheet.ciiva.com/2110/s-110-ltst-c171kskt-2110147.pdf?src-supplier=Digi-Key; ComponentLink8URL: https://datasheet.ciiva.com/2110/s-110-ltst-c171kskt-2110149.pdf?src-supplier=Digi-Key; ComponentLink8Description: https://datasheet.ciiva.com/2110/s-110-ltst-c171kskt-2110149.pdf?src-supplier=Digi-Key; Supplier Part Number 1: 6920950
D3 = CMP-22017-000007-1: LED GREEN CLEAR CHIP SMD; Luminous Intensity: 12mcd; Lens Color: Colorless; Dominant Wavelength: 569nm; Number of LEDs: 1; Power Dissipation: 100mW; Viewing Angle: 130°; Reverse Voltage: 5V; Test Current: 10mA; Forward Voltage: 2.1V; Wavelength: 585nm; Lens Style: Diffused; Forward Current: 30mA; Height: 0.8mm; Mount: Surface Mount; Package Quantity: 1; Length: 2mm; Case Code (Metric): 2012; Number of Pins: 2; Number of Elements: 1; Packaging: Tape and Reel; Color: GREEN; Min Operating Temperature: -55°C; Case/Package: 0805; Power Rating: 100mW; Max Operating Temperature: 85°C; Radiation Hardening: No; Depth: 1.25mm; Lens Transparency: Clear; Width: 1.25mm; Lead Free: Lead Free; Case Code (Imperial): 0805; Illumination Color: Green; Manufacturer Part Number: LTST-C171GKT; Package: 0805
J4 = L717SDE09PA4CH4RC309: CONN D-SUB PLUG 9POS R/A SLDR; Number of Terminals/Pins: 9; Connector Type: D-Sub,Plug; Voltage Rating: 250V; Current Rating: 5A; Number of Ports: 1; Pitch: 2.74mm; Value: N/A; Package: N/A; Supplier 1: Allied Electronics; RoHS: Yes; Category: Uncategorized; Mount: Through Hole; Contact Plating: Gold; Contact Material: Brass; Color: Black; Housing Material: Thermoplastic; Min Operating Temperature: -55°C; Max Operating Temperature: 155°C; Number of Rows: 2; Packaging: Tray; Number of Positions: 9; Termination: Solder; Max Supply Voltage (AC): 250V; Number of Contacts: 9; Orientation: Right Angle; Series: SD; Contact Type: Signal; Length: 30.81mm; Depth: 20.3mm; Lead Free: Lead Free; RoHS Compliant: Yes; ComponentLink1URL: https://datasheet.ciiva.com/16443/l717sde09pa4ch4rc309-16443356.pdf?src-supplier=Future+Electronics; ComponentLink1Description: https://datasheet.ciiva.com/16443/l717sde09pa4ch4rc309-16443356.pdf?src-supplier=Future+Electronics; ComponentLink2URL: https://datasheet.ciiva.com/12662/l717sde09pa4ch4rc309-12662371.pdf?src-supplier=Mouser; ComponentLink2Description: https://datasheet.ciiva.com/12662/l717sde09pa4ch4rc309-12662371.pdf?src-supplier=Mouser; ComponentLink3URL: https://datasheet.ciiva.com/16914/70145027-16914009.pdf?src-supplier=Allied+Electronics; ComponentLink3Description: https://datasheet.ciiva.com/16914/70145027-16914009.pdf?src-supplier=Allied+Electronics; ComponentLink4URL: https://datasheet.ciiva.com/16748/sd-hdh808-16748518.pdf?; ComponentLink4Description: https://datasheet.ciiva.com/16748/sd-hdh808-16748518.pdf?; Supplier Part Number 1: 70145033; Manufacturer Part Number: L717SDE09PA4CH4RC309
J5 = CMP-2000-05419-1: CONN HEADER VERT 4POS 2.54MM; Material, Housing: Polyester; Primary Type: InterconnectSystem; Mount Angle: Vertical; Color, Housing: White; Current, Rating: 5 / A; Agency Approvals: CSA,UL; Contact Termination Area Plating: Tin; Temperature, Operating: -55to+105 / degC; Standards: RoHSCompliant,ELVCompliant,UL94V-0; Number of Positions: 4; Brand/Series: MTA-100Series; Angle: Straight; Pin Spacing: 0.1 / "; Material, Contact: CopperAlloy; Connector Type: MTA-100; Special Features: Pinstrip; Mounting Hole Size: 0.04 / "; Contact Centerline Spacing: 0.100 / in.; Voltage, Rating: 250 / V; Manufacturer URL: http://www.te.com/; Length, Pin: 0.14 / "; Length, Overall: 0.4 / "; Color: White; Flammability Rating: UL94V-0; Mounting Type: PCMount; Termination: Solder; Datasheet URL: https://datasheet.ciiva.com/16286/eng-ds-82056-mta-0608-16286228.pdf; Number of Contacts: 4; Contact Shape: Square; Contact Mating Area Plating: Tin; Length, Terminal Post: 0.14 / in.; Size, Post: 0.025 / in.; Contact Plating: Tin; Type: PCBPlug; Datasheet Version: Dec-14; Number of Rows: 1; Manufacturer Part Number: 640456-4; Package: N/A; Value: N/A
J9 = 61301221121: CONN HEADER VERT 12POS 2.54MM; Manufacturer: WURTH ELEKTRONIK; Number of Positions: 12; Gender: Male; Voltage Rating: 250V; Pitch: 0.1inch; Supplier 1: Digi-Key; RoHS: Yes; Category: Headers and Wire Housings; Stock 1: 5429; Pricing 1: 1=0.83000, 10=0.70700, 25=0.58920, 50=0.49100, 100=0.44700, 1000=0.40600 (USD); Mount: Through Hole; Contact Plating: Gold; Contact Material: Copper Alloy,Copper; Color: Black; Contact Shape: Square; Contact Finish - Mating: GOLD; Insulation Material: Nylon; Insulation Color: Black; Min Operating Temperature: -40°C; Max Operating Temperature: 105°C; Number of Rows: 2; Packaging: Bulk; Termination: Solder; Number of Contacts: 12; Connector Type: Header; Fastening Type: Pull; Series: WR-PHD; Contact Type: Male Pin; Row Spacing: 0.1inch; Contact Mating Length: 0.236inch; RoHS Compliant: Yes; Flammability Rating: UL94 V-0; ComponentLink1URL: http://www.farnell.com/datasheets/1442180.pdf?src-supplier=Farnell; ComponentLink1Description: http://www.farnell.com/datasheets/1442180.pdf?src-supplier=Farnell; ComponentLink2URL: http://www.farnell.com/datasheets/1442180.pdf?src-supplier=Newark; ComponentLink2Description: http://www.farnell.com/datasheets/1442180.pdf?src-supplier=Newark; ComponentLink3URL: http://www.farnell.com/datasheets/1442180.pdf?src-supplier=Element14; ComponentLink3Description: http://www.farnell.com/datasheets/1442180.pdf?src-supplier=Element14; ComponentLink4URL: https://katalog.we-online.de/em/datasheet/6130xx21121.pdf?src-supplier=Digi-Key; ComponentLink4Description: https://katalog.we-online.de/em/datasheet/6130xx21121.pdf?src-supplier=Digi-Key; Supplier Part Number 1: 732-5297-ND; Package: N/A; Value: N/A; Manufacturer Part Number: 61301221121
L10 = CMP-006-00021-3: CMC 100UH 200MA 2LN SMD AEC-Q200; Manufacturer: MURATA; Pins: 4; Min Operating Temperature: -40°C; Max Operating Temperature: 125°C; Mounting Technology: sm; RoHS Compliant: Yes; Package: 4-SMD; Manufacturer Part Number: DLW43SH101XK2L
R45 R46 R66 R71 R87 R89 R90 R93 R102 R108 R197 R198 R223 R228 R235 R236 = ERJ3EKF1002V: RES SMD 10K OHM 1% 1/10W 0603; Manufacturer: PANASONIC; Manufacturer Part Number: ERJ-3EKF1002V; Temperature Coefficient: 100ppm/°C; Power Rating: 100mW; Voltage Rating: 75V; Value: 10kΩ; Supplier 1: Rs; RoHS: Yes; Category: Chip SMD Resistors; Stock 1: 10000; Mount: Surface Mount; Package: 0603; Number of Pins: 2; Contact Plating: Tin; Case Code (Metric): 1608; Case Code (Imperial): 0603; Size Code: 0603; Min Operating Temperature: -55°C; Max Operating Temperature: 155°C; Tolerance: 1%; Resistor Type: Thick Film; Packaging: Tape and Reel; Package Quantity: 1; Number of Terminations: 2; Termination: SMD/SMT; Voltage Rating (DC): 75V; Features: Automotive AEC-Q200; Series: ERJ; Technology: THICK FILM; Resistance Tolerance: 1%; Construction: Rectangular; Length: 1.6mm; Width: 0.8mm; Height: 0.45mm; Depth: 0.8mm; Radiation Hardening: No; Reach SVHC Compliant: Yes; Military Standard: Not; Lead Free: Lead Free; RoHS Compliant: Yes; ComponentLink1URL: https://datasheet.ciiva.com/7830/aoa0000ce2-7830729.pdf?src-supplier=Element14; ComponentLink1Description: https://datasheet.ciiva.com/7830/aoa0000ce2-7830729.pdf?src-supplier=Element14; ComponentLink2URL: https://datasheet.ciiva.com/46372/1678782-46372725.pdf?src-supplier=Element14; ComponentLink2Description: https://datasheet.ciiva.com/46372/1678782-46372725.pdf?src-supplier=Element14; ComponentLink3URL: https://datasheet.ciiva.com/28514/426256-28514198.pdf?src-supplier=Element14; ComponentLink3Description: https://datasheet.ciiva.com/28514/426256-28514198.pdf?src-supplier=Element14; ComponentLink4URL: https://datasheet.ciiva.com/24070/aoa0000ce2-24070318.pdf?src-supplier=Mouser; ComponentLink4Description: https://datasheet.ciiva.com/24070/aoa0000ce2-24070318.pdf?src-supplier=Mouser; ComponentLink5URL: https://datasheet.ciiva.com/16759/70260748-16759807.pdf?src-supplier=Allied+Electronics; ComponentLink5Description: https://datasheet.ciiva.com/16759/70260748-16759807.pdf?src-supplier=Allied+Electronics; ComponentLink6URL: https://datasheet.ciiva.com/9194/aoa0000ce2-9194199.pdf?src-supplier=Avnet; ComponentLink6Description: https://datasheet.ciiva.com/9194/aoa0000ce2-9194199.pdf?src-supplier=Avnet; ComponentLink7URL: https://datasheet.ciiva.com/48530/aoa0000ce2-48530988.pdf?src-supplier=Avnet; ComponentLink7Description: https://datasheet.ciiva.com/48530/aoa0000ce2-48530988.pdf?src-supplier=Avnet; ComponentLink8URL: https://datasheet.ciiva.com/30208/aoa0000ce2-30208985.pdf?src-supplier=Onlinecomponents.com; ComponentLink8Description: https://datasheet.ciiva.com/30208/aoa0000ce2-30208985.pdf?src-supplier=Onlinecomponents.com; Supplier Part Number 1: 1051156
R47-R50 R76 R79 R82 R84 R192 R226 R227 R229 R232-R234 R237 R238 = CRCW06030000Z0EB: RES SMD 0 OHM JUMPER 1/10W 0603; Manufacturer: VISHAY DALE; Manufacturer Part Number: CRCW06030000Z0EBC; Max Power Dissipation: 100mW; Voltage Rating: 75V; Tolerance: 1%; Temperature Coefficient: 100ppm/°C; Value: 0Ω; Supplier 1: Newark; RoHS: Yes; Category: Chip SMD Resistors; Stock 1: 110000; Pricing 1: 1=0.00300, 10000=0.00300 (USD); Package: 0603; Number of Pins: 2; Case Code (Imperial): 0603; Case Code (Metric): 1608; Weight: 7.1E-05oz; Contact Plating: Tin; Size Code: 0603; Min Operating Temperature: -55°C; Max Operating Temperature: 155°C; Packaging: Tape and Reel; Resistor Type: Thick Film; Number of Terminations: 2; Features: Automotive AEC-Q200; Package Quantity: 10000; Termination: SMD/SMT; Voltage Rating (DC): 75V; Series: CRCW; Construction: Rectangular; Technology: THICK FILM; Length: 1.55mm; Width: 0.033inch; Height: 0.45mm; Depth: 0.85mm; Ratings: AEC-Q200; Radiation Hardening: No; RoHS Compliant: Yes; Lead Free: Lead Free; Military Standard: Not; ComponentLink1URL: https://datasheet.ciiva.com/11808/0900766b80d98afc-11808678.pdf?src-supplier=Rs; ComponentLink1Description: https://datasheet.ciiva.com/11808/0900766b80d98afc-11808678.pdf?src-supplier=Rs; ComponentLink2URL: https://datasheet.ciiva.com/2563/dcrcwe3-2563949.pdf?src-supplier=Digi-Key; ComponentLink2Description: https://datasheet.ciiva.com/2563/dcrcwe3-2563949.pdf?src-supplier=Digi-Key; ComponentLink3URL: https://datasheet.ciiva.com/5550/dcrcwe3-109170-5550748.pdf?src-supplier=Mouser; ComponentLink3Description: https://datasheet.ciiva.com/5550/dcrcwe3-109170-5550748.pdf?src-supplier=Mouser; ComponentLink4URL: https://datasheet.ciiva.com/16430/dcrcwe3-16430060.pdf?src-supplier=Future+Electronics; ComponentLink4Description: https://datasheet.ciiva.com/16430/dcrcwe3-16430060.pdf?src-supplier=Future+Electronics; ComponentLink5URL: https://datasheet.ciiva.com/7791/dcrcwe3-7791992.pdf?src-supplier=Element14; ComponentLink5Description: https://datasheet.ciiva.com/7791/dcrcwe3-7791992.pdf?src-supplier=Element14; Supplier Part Number 1: 48P7902
R92 R96 R101 R107 R109-R112 R239 R240 = CRCW060320K0FKTA: RES SMD 20K OHM 1% 1/10W 0603; Manufacturer: VISHAY DALE; Temperature Coefficient: 100ppm/°C; Voltage Rating: 75V; Max Power Dissipation: 100mW; Value: 20kΩ; Supplier 1: Arrow Electronics; Manufacturer Part Number: CRCW060320K0FKTA; RoHS: No; Category: Chip SMD Resistors; Stock 1: 8; Pricing 1: 1=0.14090 (USD); Package: 0603; Number of Pins: 2; Contact Plating: Tin,Lead; Weight: 7.1E-05oz; Case Code (Metric): 1608; Case Code (Imperial): 0603; Min Operating Temperature: -55°C; Max Operating Temperature: 155°C; Tolerance: 1%; Resistor Type: Thick Film; Package Quantity: 5000; Packaging: Tape and Reel; Number of Terminations: 2; Termination: SMD/SMT; Power Dissipation: 100mW; Voltage Rating (DC): 75V; Features: Automotive AEC-Q200; Series: CRCW; Construction: Rectangular; Resistance Tolerance: 1%; Length: 1.55mm; Width: 0.033inch; Height: 0.02inch; Depth: 0.85mm; Radiation Hardening: No; Lead Free: Contains Lead; Military Standard: Not; RoHS Compliant: No; ComponentLink1URL: https://datasheet.ciiva.com/3883/dcrcw-3883254.pdf?src-supplier=Arrow+Electronics; ComponentLink1Description: https://datasheet.ciiva.com/3883/dcrcw-3883254.pdf?src-supplier=Arrow+Electronics; ComponentLink2URL: https://datasheet.ciiva.com/26933/getdatasheetpartid-28850-26933811.pdf?src-supplier=Verical; ComponentLink2Description: https://datasheet.ciiva.com/26933/getdatasheetpartid-28850-26933811.pdf?src-supplier=Verical; ComponentLink3URL: https://datasheet.ciiva.com/9033/dcrcw-9033436.pdf?src-supplier=Avnet; ComponentLink3Description: https://datasheet.ciiva.com/9033/dcrcw-9033436.pdf?src-supplier=Avnet; ComponentLink4URL: https://datasheet.ciiva.com/2565/dcrcw-2565123.pdf?src-supplier=Digi-Key; ComponentLink4Description: https://datasheet.ciiva.com/2565/dcrcw-2565123.pdf?src-supplier=Digi-Key; Supplier Part Number 1: CRCW060320K0FKTA
R193-R196 = RC0603JR-07120RL: RES 120 OHM 5% 1/10W 0603; Manufacturer: YAGEO; Voltage Rating (DC): 50V; Temperature Coefficient: 100ppm/°C; Power Rating: 100mW; Tolerance: 5%; Lead Free: Lead Free; Package: 0603; Max Operating Temperature: 155°C; Length: 1.6mm; Construction: Rectangular; Case Code (Imperial): 0603; Number of Pins: 2; Termination: SMD/SMT; Width: 0.8mm; Height: 0.022inch; Military Standard: Not; Series: RC; Number of Terminations: 2; Package Quantity: 1; Resistance Tolerance: 5%; Voltage Rating: 50V; Case Code (Metric): 1608; Features: Moisture Resistant; REACH SVHC: No SVHC; Min Operating Temperature: -55°C; Size Code: 0603; Packaging: Tape and Reel; Depth: 0.8mm; Resistor Type: Thick Film; RoHS Compliant: Yes; Supplier 1: Rs; Supplier Part Number 1: 2424206; Manufacturer Part Number: RC0603JR-07120RL
R221 R222 R224 R225 R230 R231 = RC0603FR-13330RL: RES 330 OHM 1% 1/10W 0603; Manufacturer: YAGEO; Voltage Rating: 50V; Temperature Coefficient: 100ppm/°C; Value: 330Ω; Supplier 1: Future Electronics; Manufacturer Part Number: RC0603FR-13330RL; RoHS: Yes; Category: Chip SMD Resistors; Stock 1: 560000; Pricing 1: 20000=0.00130, 80000=0.00120, 400000=0.00120, 800000=0.00110, 2500000=0.00110 (USD); Package: 0603; Case Code (Imperial): 0603; Case Code (Metric): 1608; Min Operating Temperature: -55°C; Max Operating Temperature: 155°C; Tolerance: 1%; Packaging: Tape and Reel; Resistor Type: Thick Film; Termination: SMD/SMT; Series: RC; Construction: Rectangular; Length: 1.6mm; Width: 0.8mm; Height: 0.45mm; Depth: 0.8mm; Military Standard: Not; RoHS Compliant: Yes; ComponentLink1URL: https://datasheet.ciiva.com/12561/rc0603-272842-12561430.pdf?src-supplier=Mouser; ComponentLink1Description: https://datasheet.ciiva.com/12561/rc0603-272842-12561430.pdf?src-supplier=Mouser; Supplier Part Number 1: 4067719
U5 = TMDSCNCD280039C: EVAL BOARD FOR TMS320F280039C; Supplier 1: Mouser; Manufacturer Part Number: TMDSCNCD280039C; RoHS: No; Category: Embedded Processors and Controllers; Stock 1: 11; Pricing 1: 1=99.75000, 10=99.75000, 50=99.75000, 100=99.75000, 1000=99.75000, 10000=99.75000 (USD); Supplier Part Number 1: 595-TMDSCNCD280039C; Value: N/A; Package: N/A
U36 = CMP-04872-000086-1: IC TXRX/ISO FULL 1/1 8SOIC; RoHS Compliant: Yes; Manufacturer Part Number: ISO1042BQDWVRQ1; Package: 8-SOIC; Value: N/A
U38 = CMP-0440-01163-3: IC BUF NON-INVERT 5.5V 20TSSOP; Bits(#): 8; Voltage(Nom)(V): 5; ICC @ Nom Voltage(Max)(mA): 0.02; VCC(Max)(V): 5.5; Output Type: CMOS; Rating: Catalog; Input Type: TTL; VCC(Min)(V): 4.5; F @ Nom Voltage(Max)(Mhz): 110; tpd @ Nom Voltage(Max)(ns): 7.9; Code_JEDEC: MO-153; PackageReference: PW0020A; DatasheetVersion: SCES573B; Generic Part Number: SN74LV541AT; Operating Temperature Range(C): -40 to 125; PackageVersion: http://www.ti.com/lit/ml/mpds362/mpds362.pdf; Package: 20-TSSOP; Value: N/A; Manufacturer Part Number: SN74LV541ATPWR

## Sheet 04 - Auxiliary Power.SchDoc: Auxiliary Power - 25kW WolfPACK FM3 Six-Pack Inv.
size 431 x 279 mm; Date: 09/2024; DocumentNumber: CRD25DA12N-FMC; Revision: 2.0; SheetNumber: 4; SheetTotal: 9; SheetSize: B
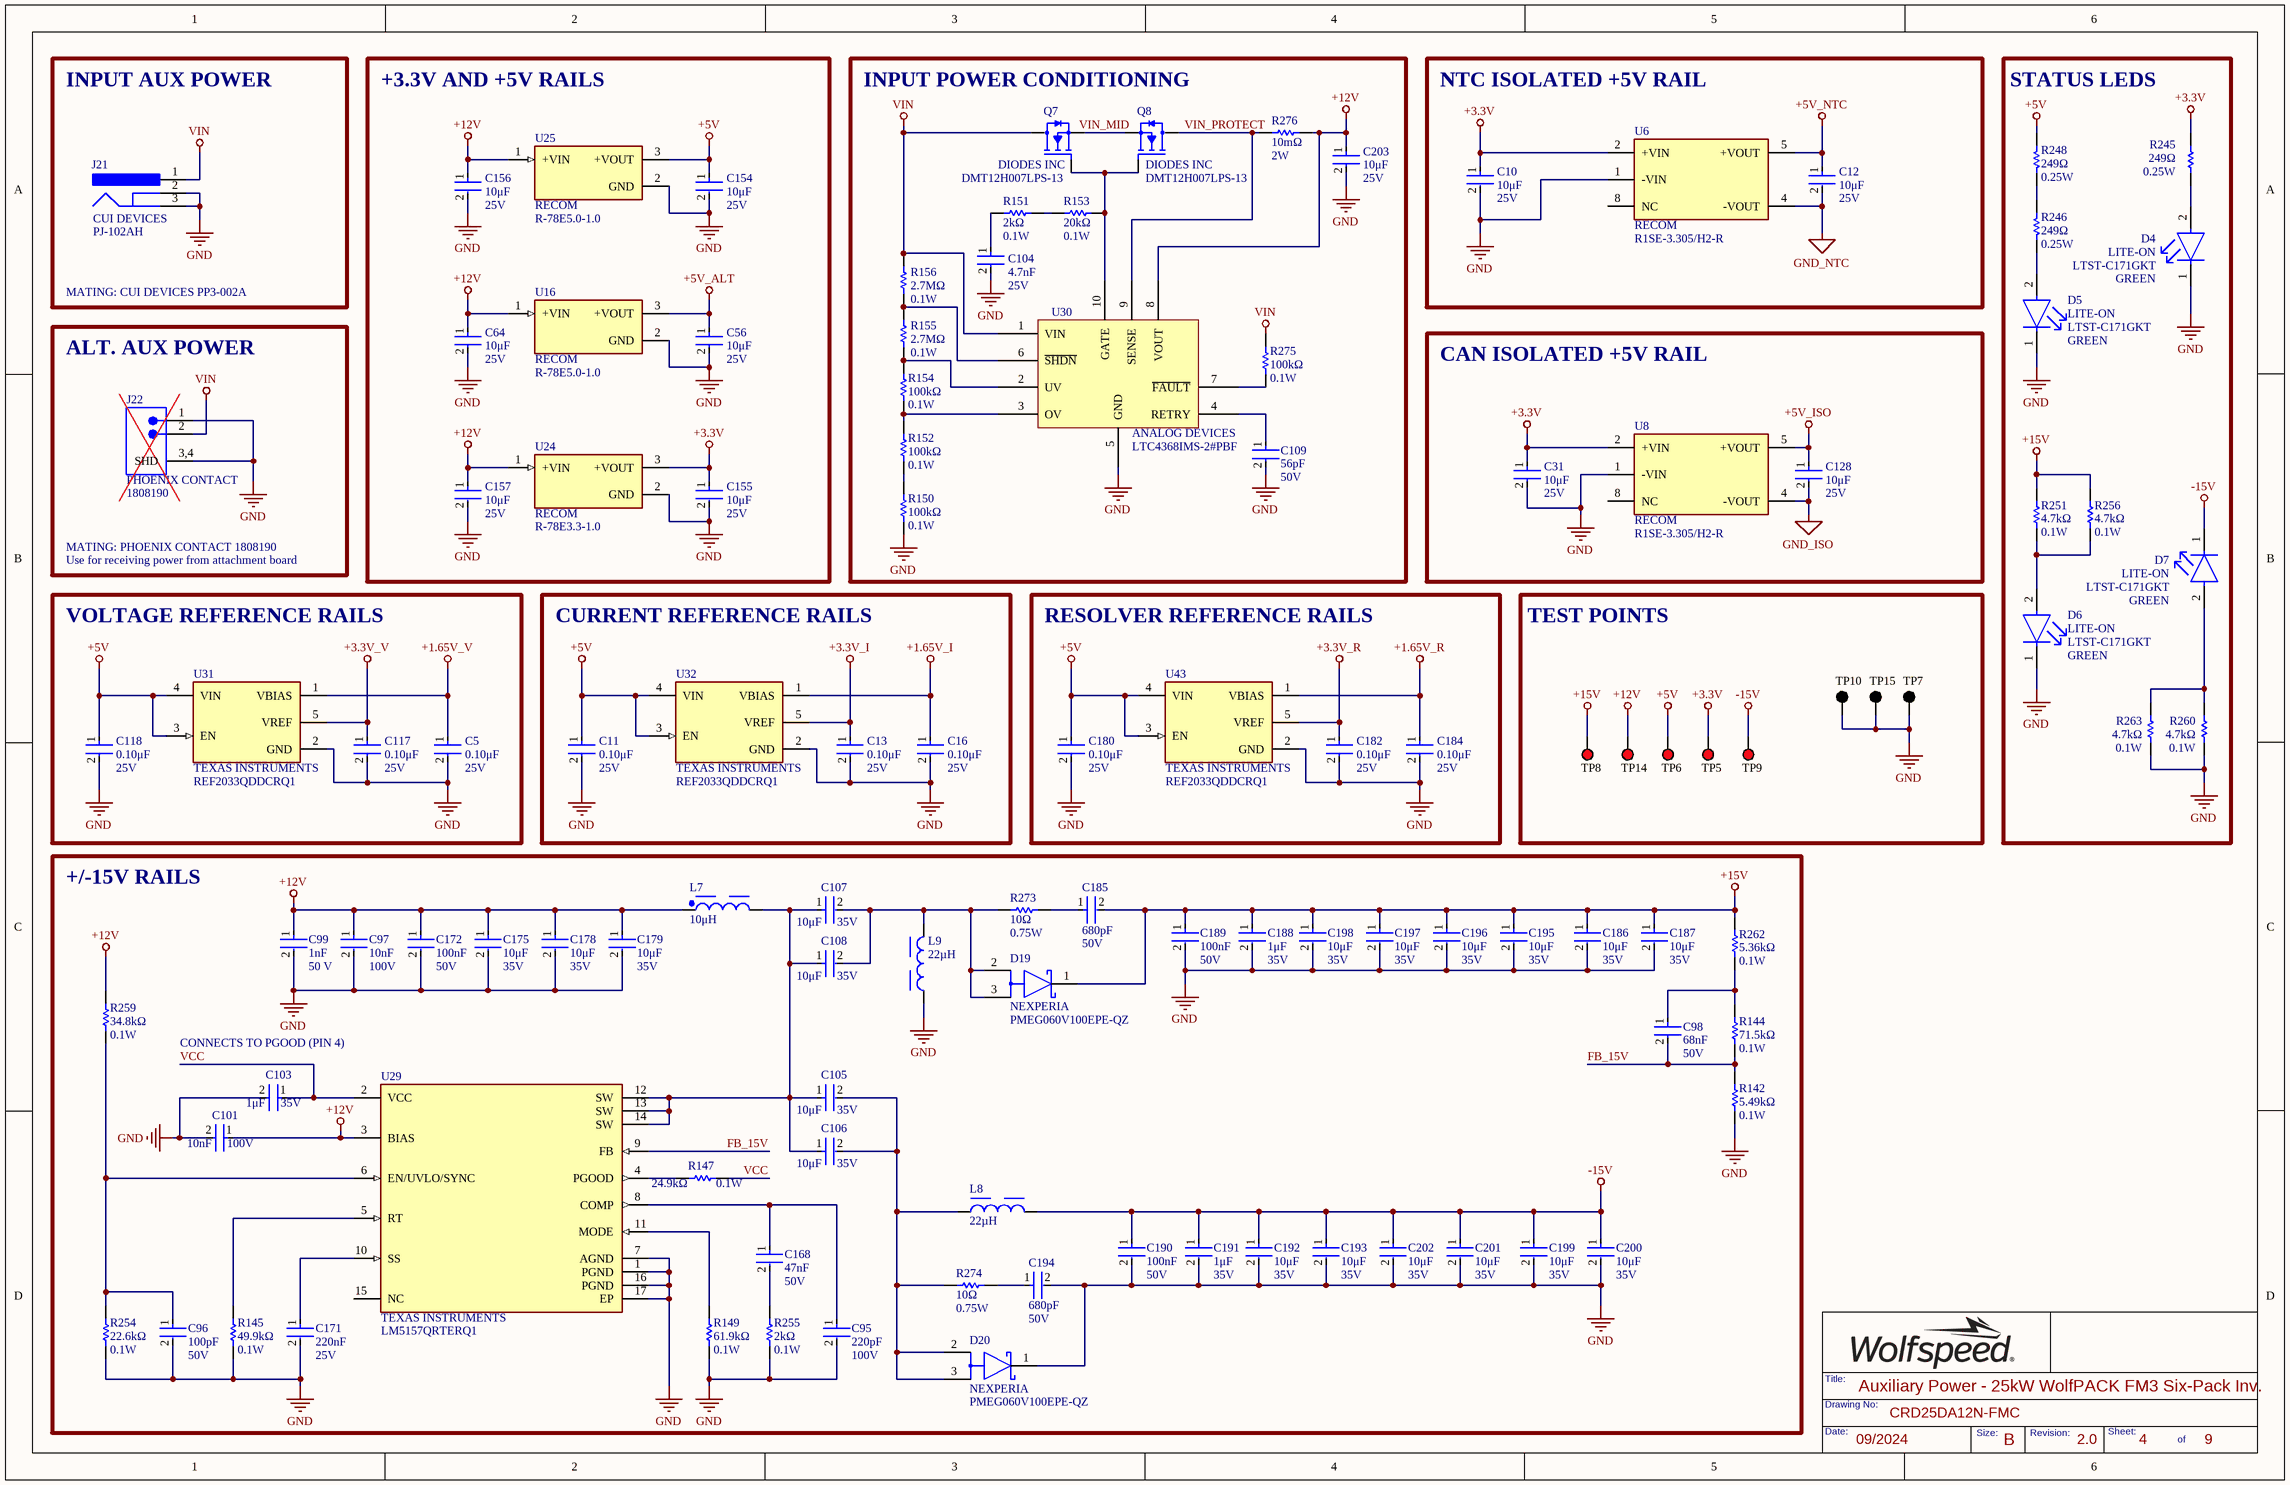
[diagram p3: 04 - Auxiliary Power.SchDoc]